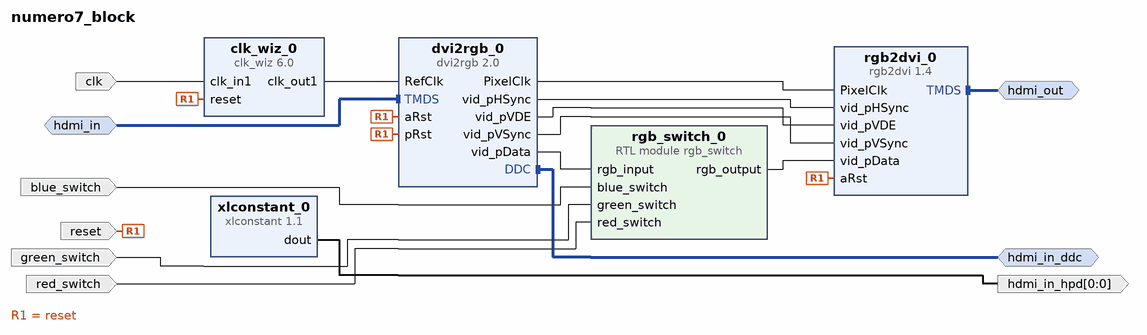
[diagram p0: block diagram of the top level]
# Vivado block design numero7_block, xc7z020clg400-1, Vivado 2022.1
create_bd_design numero7_block

create_bd_intf_port -mode Slave -vlnv digilentinc.com:interface:tmds_rtl:1.0 hdmi_in
create_bd_intf_port -mode Master -vlnv xilinx.com:interface:iic_rtl:1.0 hdmi_in_ddc
create_bd_intf_port -mode Master -vlnv digilentinc.com:interface:tmds_rtl:1.0 hdmi_out
create_bd_port -dir I red_switch
create_bd_port -dir I green_switch
create_bd_port -dir I blue_switch
create_bd_port -dir O -from 0 -to 0 hdmi_in_hpd
create_bd_port -dir I -type rst reset
set_property -dict {CONFIG.POLARITY ACTIVE_HIGH} [get_bd_ports reset]
create_bd_port -dir I -type clk clk
set_property -dict {CONFIG.FREQ_HZ 125000000} [get_bd_ports clk]

create_bd_cell -type ip -vlnv digilentinc.com:ip:dvi2rgb:2.0 dvi2rgb_0
create_bd_cell -type ip -vlnv digilentinc.com:ip:rgb2dvi:1.4 rgb2dvi_0
create_bd_cell -type ip -vlnv xilinx.com:ip:clk_wiz:6.0 clk_wiz_0
set_property -dict [list \
  CONFIG.CLKOUT1_JITTER 109.241 \
  CONFIG.CLKOUT1_REQUESTED_OUT_FREQ 200.000 \
  CONFIG.MMCM_CLKOUT0_DIVIDE_F 5.000 \
] [get_bd_cells clk_wiz_0]
create_bd_cell -type ip -vlnv xilinx.com:ip:xlconstant:1.1 xlconstant_0
create_bd_cell -type module -reference rgb_switch rgb_switch_0

# ---- connections ----

connect_bd_intf_net -intf_net TMDS_0_1 [get_bd_intf_ports hdmi_in] [get_bd_intf_pins dvi2rgb_0/TMDS]
connect_bd_intf_net [get_bd_intf_ports hdmi_in_ddc] [get_bd_intf_pins dvi2rgb_0/DDC]
connect_bd_intf_net [get_bd_intf_ports hdmi_out] [get_bd_intf_pins rgb2dvi_0/TMDS]
connect_bd_net [get_bd_ports blue_switch] [get_bd_pins rgb_switch_0/blue_switch]
connect_bd_net [get_bd_ports clk] [get_bd_pins clk_wiz_0/clk_in1]
connect_bd_net [get_bd_pins clk_wiz_0/clk_out1] [get_bd_pins dvi2rgb_0/RefClk]
connect_bd_net [get_bd_pins dvi2rgb_0/PixelClk] [get_bd_pins rgb2dvi_0/PixelClk]
connect_bd_net [get_bd_pins dvi2rgb_0/vid_pData] [get_bd_pins rgb_switch_0/rgb_input]
connect_bd_net [get_bd_pins dvi2rgb_0/vid_pHSync] [get_bd_pins rgb2dvi_0/vid_pHSync]
connect_bd_net [get_bd_pins dvi2rgb_0/vid_pVDE] [get_bd_pins rgb2dvi_0/vid_pVDE]
connect_bd_net [get_bd_pins dvi2rgb_0/vid_pVSync] [get_bd_pins rgb2dvi_0/vid_pVSync]
connect_bd_net [get_bd_ports green_switch] [get_bd_pins rgb_switch_0/green_switch]
connect_bd_net [get_bd_ports red_switch] [get_bd_pins rgb_switch_0/red_switch]
connect_bd_net [get_bd_ports reset] \
  [get_bd_pins clk_wiz_0/reset] [get_bd_pins rgb2dvi_0/aRst] [get_bd_pins dvi2rgb_0/aRst] [get_bd_pins dvi2rgb_0/pRst]
connect_bd_net [get_bd_pins rgb_switch_0/rgb_output] [get_bd_pins rgb2dvi_0/vid_pData]
connect_bd_net [get_bd_pins xlconstant_0/dout] [get_bd_ports hdmi_in_hpd]

validate_bd_design
save_bd_design
